# EAGLE schematic controlboard (EAGLE 9.2.2)
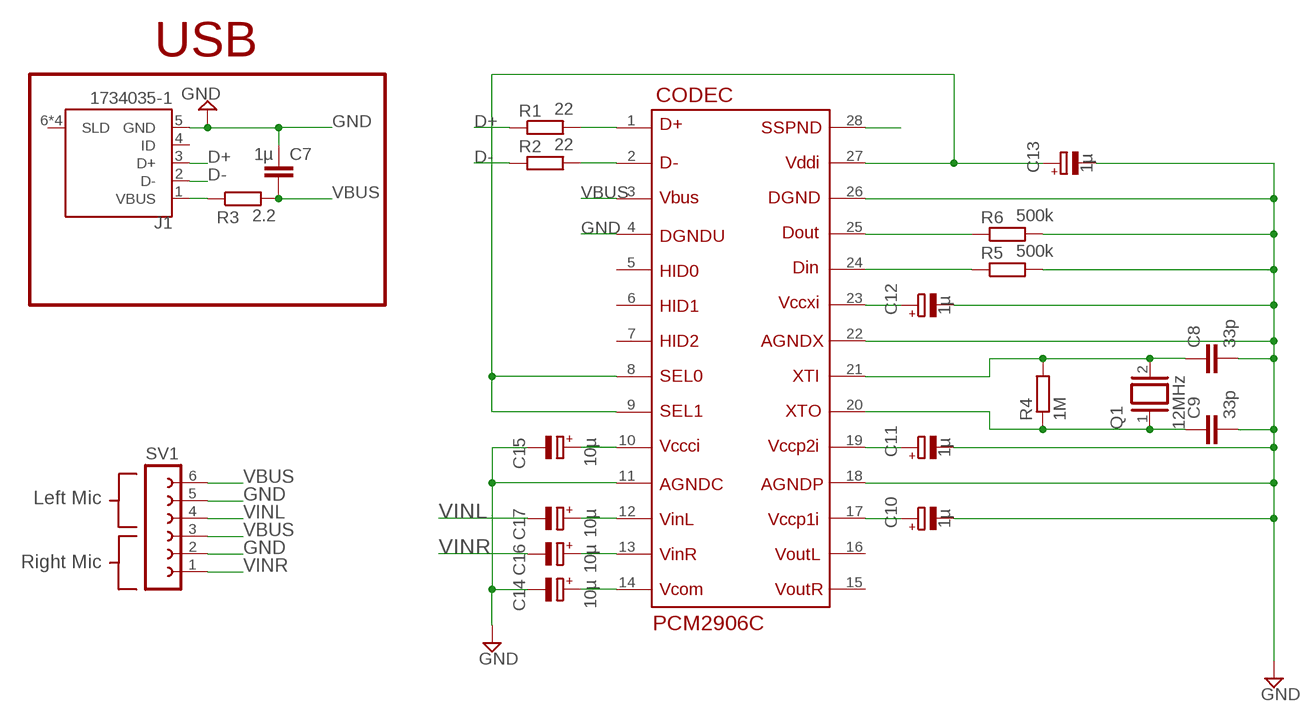
[diagram p0: schematic, sheet 1]

## Parts
C7  1µ  C-EUC0805  [C0805]
C8  33p  C-EUC0805  [C0805]
C9  33p  C-EUC0805  [C0805]
C10  1µ  CPOL-EU153CLV-0807  [153CLV-0807]
C11  1µ  CPOL-EU153CLV-0807  [153CLV-0807]
C12  1µ  CPOL-EU153CLV-0807  [153CLV-0807]
C13  1µ  CPOL-EU153CLV-0807  [153CLV-0807]
C14  10µ  CPOL-EU153CLV-0807  [153CLV-0807]
C15  10µ  CPOL-EU153CLV-0807  [153CLV-0807]
C16  10µ  CPOL-EU153CLV-0807  [153CLV-0807]
C17  10µ  CPOL-EU153CLV-0807  [153CLV-0807]
CODEC  PCM2906C  [SOP65P780X200-28N]
J1  1734035-1  [TE_1734035-1]
Q1  12MHz  XTAL/S  [QS]
R1  22  R-EU_R0805  [R0805]
R2  22  R-EU_R0805  [R0805]
R3  2.2  R-EU_R0805  [R0805]
R4  1M  R-EU_R0805  [R0805]
R5  500k  R-EU_R0805  [R0805]
R6  500k  R-EU_R0805  [R0805]
SV1  FE06-1  [FE06]

## Nets
D+: J1.3(D+) R1.1
D-: J1.2(D-) R2.1
GND: C7.1 C8.2 C9.2 C10.- C11.- C12.- C13.- C14.- C15.- CODEC.4 CODEC.11 CODEC.18 CODEC.22 CODEC.26 J1.5(GND) R5.2 R6.2 SV1.2 SV1.5
N$1: CODEC.1 R1.2
N$2: CODEC.2 R2.2
N$3: J1.1(VBUS) R3.1
N$4: C11.+ CODEC.19
N$5: C9.1 CODEC.20 Q1.1 R4.1
N$6: C8.1 CODEC.21 Q1.2 R4.2
N$7: C10.+ CODEC.17
N$8: C12.+ CODEC.23
N$9: CODEC.25 R6.1
N$10: CODEC.24 R5.1
N$12: C15.+ CODEC.10
N$13: C14.+ CODEC.14
N$14: CODEC.28
N$15: C13.+ CODEC.8 CODEC.9 CODEC.27
N$17: C17.+ CODEC.12
N$18: C16.+ CODEC.13
VBUS: C7.2 CODEC.3 R3.2 SV1.3 SV1.6
VINL: C17.- SV1.4
VINR: C16.- SV1.1
Unconnected: CODEC.5 CODEC.6 CODEC.7 CODEC.15 CODEC.16 J1.4(ID) J1.6(SLD) J1.7(SLD) J1.8(SLD) J1.9(SLD)

## Notes on the sheet
- USB
- Left Mic
- Right Mic

## Library data of the parts
C7-C9 = rcl:C-EU: CAPACITOR, European symbol; SPICEPREFIX: C
C10-C17 = resistor:CPOL-EU: POLARIZED CAPACITOR, European symbol
CODEC = PCM2906C_custom:PCM2906C
J1 = 1734035-1:1734035-1: Conn Mini USB 2.0 Type B RCP 5 POS 0.8mm Solder RA SMD 5 Terminal 1 Port Tray; AVAILABILITY: Unavailable; CENTERLINE_PITCH: .8 mm[.031 in]; COMMENT: 1734035-1; DESCRIPTION: Mini USB,R/A,SMT,B Type,pbFree; EU_ROHS_COMPLIANCE: Compliant; LINK: http://www.te.com/usa-en/product-1734035-1.html; MF: TE Connectivity; MP: 1734035-1; NUMBER_OF_POSITIONS: 5; PACKAGE: None; PRICE: None; PRODUCT_TYPE: Connector
Q1 = special:XTAL/S: CRYSTAL
R1-R6 = rcl:R-EU_: RESISTOR, European symbol; SPICEPREFIX: R
SV1 = con-lsta:FE06-1: FEMALE HEADER; OC_FARNELL: unknown; OC_NEWARK: unknown